# Altium schematic sheet USB C conn & ctrl.SchDoc: RK3399 SOM Module
size A4; Date: 23.05.2023; Author: Łukasz Nowarkiewicz; SheetNumber: 13; SheetTotal: 21; RegistrationBookNumber: 144201; title_sheet: USB C Connection control
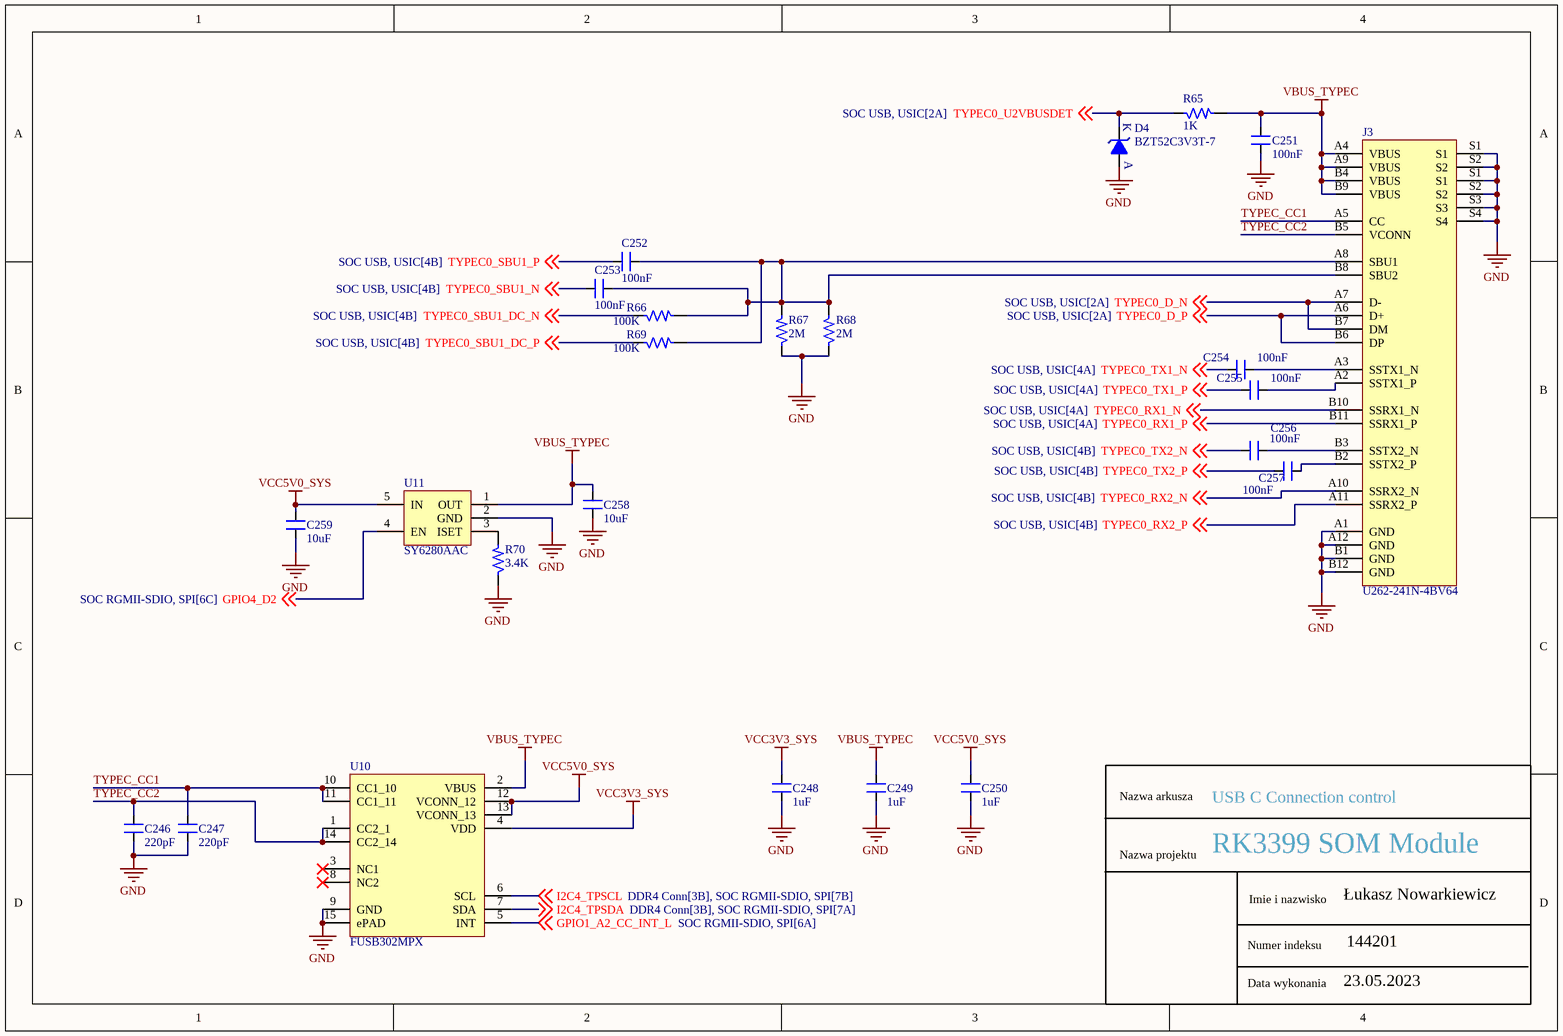
[diagram p0: USB C conn & ctrl.SchDoc]

## Parts
C246  220pF  [CAP_0402]
C247  220pF  [CAP_0402]
C248  1uF  [CAP_0402]
C249  1uF  [CAP_0402]
C250  1uF  [CAP_0402]
C251  100nF  [CAP_0603]
C252  100nF  [CAP_0402]
C253  100nF  [CAP_0402]
C254  100nF  [CAP_0402]
C255  100nF  [CAP_0402]
C256  100nF  [CAP_0402]
C257  100nF  [CAP_0402]
C258  10uF  [CAP_0402]
C259  10uF  [CAP_0402]
D4  BZT52C3V3T-7  [DIO_SOD523]
J3  U262-241N-4BV64  [CON24_19.64_U262-241N-4BV64_TH_RA]
R65  1K  [RES_0402]
R66  100K  [RES_0402]
R67  2M  [RES_0402]
R68  2M  [RES_0402]
R69  100K  [RES_0402]
R70  3.4K  [RES_0402]
U10  FUSB302MPX  [MLP-14_98.4X98.4_SMD]
U11  SY6280AAC  [SOT23-5]

## Nets
GND: C246.1 C247.1 C248.1 C249.1 C250.1 C251.1 C258.1 C259.1 D4.A J3.A1(GND) J3.A12(GND) J3.B1(GND) J3.B12(GND) J3.S1 J3.S2 J3.S3 J3.S4 R67.1 R68.1 R70.1 U10.9(GND) U10.15(ePAD) U11.2(GND)
VBUS_TYPEC: C249.2 C251.2 C258.2 J3.A4(VBUS) J3.A9(VBUS) J3.B4(VBUS) J3.B9(VBUS) R65.2 U10.2(VBUS) U11.1(OUT)
VCC3V3_SYS: C248.2 U10.4(VDD)
VCC5V0_SYS: C250.2 C259.2 U10.12(VCONN_12) U10.13(VCONN_13) U11.5(IN)
GPIO1_A2_CC_INT_L: U10.5(INT) ; off-sheet GPIO1_A2_CC_INT_L
GPIO4_D2: U11.4(EN) ; off-sheet GPIO4_D2
I2C4_TPSCL: U10.6(SCL) ; off-sheet I2C4_TPSCL
I2C4_TPSDA: U10.7(SDA) ; off-sheet I2C4_TPSDA
TYPEC0_D_N: J3.A7(D-) J3.B7(DM) ; off-sheet TYPEC0_D_N
TYPEC0_D_P: J3.A6(D+) J3.B6(DP) ; off-sheet TYPEC0_D_P
TYPEC0_RX1_N: J3.B10(SSRX1_N) ; off-sheet TYPEC0_RX1_N
TYPEC0_RX1_P: J3.B11(SSRX1_P) ; off-sheet TYPEC0_RX1_P
TYPEC0_RX2_N: J3.A10(SSRX2_N) ; off-sheet TYPEC0_RX2_N
TYPEC0_RX2_P: J3.A11(SSRX2_P) ; off-sheet TYPEC0_RX2_P
TYPEC0_SBU1_DC_N: R66.1 ; off-sheet TYPEC0_SBU1_DC_N
TYPEC0_SBU1_DC_P: R69.1 ; off-sheet TYPEC0_SBU1_DC_P
TYPEC0_SBU1_N: C253.1 ; off-sheet TYPEC0_SBU1_N
TYPEC0_SBU1_P: C252.1 ; off-sheet TYPEC0_SBU1_P
TYPEC0_TX1_N: C254.1 ; off-sheet TYPEC0_TX1_N
TYPEC0_TX1_P: C255.1 ; off-sheet TYPEC0_TX1_P
TYPEC0_TX2_N: C256.1 ; off-sheet TYPEC0_TX2_N
TYPEC0_TX2_P: C257.1 ; off-sheet TYPEC0_TX2_P
TYPEC0_U2VBUSDET: D4.K R65.1 ; off-sheet TYPEC0_U2VBUSDET
TYPEC_CC1: C247.2 J3.A5(CC) U10.10(CC1_10) U10.11(CC1_11)
TYPEC_CC2: C246.2 J3.B5(VCONN) U10.1(CC2_1) U10.14(CC2_14)
NetC252_2: C252.2 C253.2 J3.A8(SBU1) J3.B8(SBU2) R66.2 R67.2 R68.2 R69.2
NetC254_2: C254.2 J3.A3(SSTX1_N)
NetC255_2: C255.2 J3.A2(SSTX1_P)
NetC256_2: C256.2 J3.B3(SSTX2_N)
NetC257_2: C257.2 J3.B2(SSTX2_P)
NetR70_2: R70.2 U11.3(ISET)

Not connected (* = marked no-connect by the designer): U10 3(NC1)* 8(NC2)*

## Notes on the sheet
- Nazwa arkusza
- Nazwa projektu
- Imie i nazwisko
- Data wykonania
- Numer indeksu

## Library data of the parts
C246 C247 = CAP_220pF-10V-10%-0402: 220pF ±10% 10V Ceramic Capacitor X7R 0402 (1005 Metric); Manufacturer: KEMET; Manufacturer Part Number: C0402C221K8RAC7867; Case/Package: 0402; Supplier-1: Digikey
C248-C250 = CAP_1uF-10V-10%-0402: 1µF ±10% 10V Ceramic Capacitor X6S 0402 (1005 Metric); Manufacturer: Murata Electronics; Manufacturer Part Number: GRT155C81A105KE01D; Case/Package: 0402; Supplier-1: Digikey
C251 = CAP_100nF-10V-5%-0603: 0.1µF ±10% 10V Ceramic Capacitor X7R 0603 (1608 Metric); Manufacturer: Yageo; Manufacturer Part Number: CC0603KRX7R6BB104; Case/Package: 0603; Supplier-1: Digikey
C252-C257 = CAP_100nF-25V-10%-0402: 0.1µF ±10% 25V Ceramic Capacitor X7R 0402 (1005 Metric); Manufacturer: Walsin Technology Corporation; Manufacturer Part Number: 0402B104K250CT; Case/Package: 0402; Supplier-1: Digikey
C258 C259 = CAP_10uF-10V-20%-0402: 10µF ±20% 10V Ceramic Capacitor X5R 0402 (1005 Metric); Manufacturer Part Number: CL05A106MP5NUNC; Manufacturer: Samsung Electro-Mechanics; Case/Package: 0402; Supplier-1: Digikey
D4 = DIO-Z_3.3V-300mW-SOD-523: Zener Diode 3.3V 300mW ±6% Surface Mount SOD-523; Manufacturer: Diodes Incorporated; Manufacturer Part Number: BZT52C3V3T-7; Case/Package: SOD523; Supplier-1: Digikey
J3 = CON-TYPEC_U262-241N-4BV64-SMD: USB - Type C Female 24 SMD USB Connectors RoHS; Manufacturer: XKB Connectivity; Manufacturer Part Number: U262-241N-4BV64; Case/Package: SMD; Supplier-1: LCSC
R65 = RES_1K-0.1W-1%-0402: 1 kOhms ±1% 0.1W, 1/10W Chip Resistor 0402 (1005 Metric) Anti-Sulfur Thin Film; Manufacturer: Vishay Beyschlag/Draloric/BC Components; Manufacturer Part Number: MCS04020C1001FE000; Case/Package: 0402; Supplier-1: Digikey
R66 R69 = RES_100K-0.1W-1%-0402: 100 kOhms ±1% 0.1W, 1/10W Chip Resistor 0402 (1005 Metric) Anti-Sulfur Thin Film; Manufacturer: Vishay Beyschlag/Draloric/BC Components; Manufacturer Part Number: MCS04020C1003FE000; Case/Package: 0402; Supplier-1: Digikey
R67 R68 = RES_2M-0.1W-1%-0402: 2 MOhms ±1% 0.1W, 1/10W Chip Resistor 0402 (1005 Metric) Anti-Sulfur Thin Film; Manufacturer: Vishay Beyschlag/Draloric/BC Components; Manufacturer Part Number: MCS04020C2004FE000; Case/Package: 0402; Supplier-1: Digikey
R70 = RES_3.4K-0.1W-1%-0402: 3.4 kOhms ±1% 0.1W, 1/10W Chip Resistor 0402 (1005 Metric) Automotive AEC-Q200 Thick Film; Manufacturer: Panasonic Electronic Components; Manufacturer Part Number: ERJ-2RKF3401X; Case/Package: 0402; Supplier-1: Digikey
U10 = IC_FUSB302MPX: USB Controller USB 3.1 USB Interface 14-MLP (2.5x2.5); Manufacturer: ON Semiconductor; Manufacturer Part Number: FUSB302MPX; Case/Package: 14-MLP; Supplier-1: Digikey
U11 = REG-ADJ_5.5V-5.5V-1.25A-SOT-23-5: SOT-23-5 PMIC - Power Distribution Switches RoHS; Manufacturer: Silergy Corp; Manufacturer Part Number: SY6280AAC; Case/Package: SOT-23-5; Supplier-1: LCSC